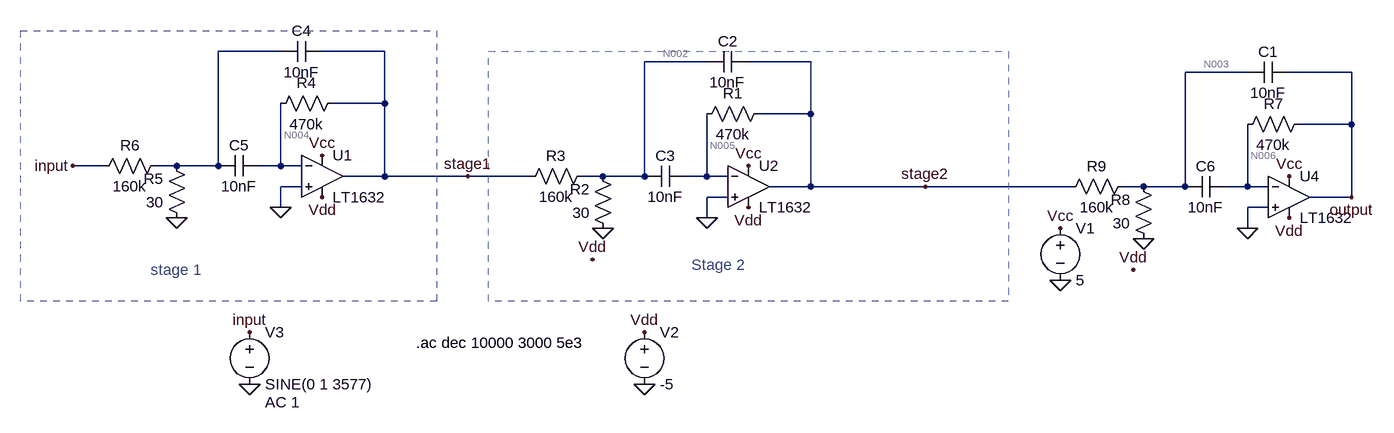
[diagram p0: schematic 2stageamplifiyer.asc]
2stageamplifiyer.asc, the LTspice schematic file:
Version 4
SHEET 1 1824 680
WIRE -544 -64 -640 -64
WIRE -384 -64 -480 -64
WIRE 112 -48 16 -48
WIRE 272 -48 176 -48
WIRE 944 -32 848 -32
WIRE 1104 -32 1008 -32
WIRE -384 16 -384 -64
WIRE -384 16 -464 16
WIRE 272 32 272 -48
WIRE 272 32 192 32
WIRE 1104 48 1104 -32
WIRE 1104 48 1024 48
WIRE -816 112 -864 112
WIRE -704 112 -736 112
WIRE -640 112 -640 -64
WIRE -640 112 -704 112
WIRE -544 112 -544 16
WIRE -544 112 -576 112
WIRE -512 112 -544 112
WIRE -384 128 -384 16
WIRE -384 128 -448 128
WIRE -256 128 -384 128
WIRE -160 128 -256 128
WIRE -48 128 -80 128
WIRE 16 128 16 -48
WIRE 16 128 -48 128
WIRE 112 128 112 32
WIRE 112 128 80 128
WIRE 144 128 112 128
WIRE -512 144 -544 144
WIRE 272 144 272 32
WIRE 272 144 208 144
WIRE 448 144 272 144
WIRE 672 144 448 144
WIRE 784 144 752 144
WIRE 848 144 848 -32
WIRE 848 144 784 144
WIRE 944 144 944 48
WIRE 944 144 912 144
WIRE 976 144 944 144
WIRE 144 160 112 160
WIRE 1104 160 1104 48
WIRE 1104 160 1040 160
WIRE -544 176 -544 144
WIRE 976 176 944 176
WIRE 112 192 112 160
WIRE 944 208 944 176
FLAG 656 288 0
FLAG 656 208 Vcc
FLAG -48 208 0
FLAG 112 192 0
FLAG -704 192 0
FLAG -544 176 0
FLAG -864 112 input
FLAG -592 368 input
FLAG -592 448 0
FLAG -480 96 Vcc
FLAG 176 112 Vcc
FLAG 16 448 0
FLAG -64 256 Vdd
FLAG 16 368 Vdd
FLAG -480 160 Vdd
FLAG 176 176 Vdd
FLAG 784 224 0
FLAG 944 208 0
FLAG 1008 128 Vcc
FLAG 768 272 Vdd
FLAG 1008 192 Vdd
FLAG 1104 160 output
FLAG -256 128 stage1
FLAG 448 144 stage2
SYMBOL voltage 656 192 R0
WINDOW 123 0 0 Left 2
WINDOW 39 0 0 Left 2
SYMATTR InstName V1
SYMATTR Value 5
SYMBOL res 96 48 R270
WINDOW 0 32 56 VTop 2
WINDOW 3 0 56 VBottom 2
SYMATTR InstName R1
SYMATTR Value 470k
SYMBOL res -32 224 R180
WINDOW 0 36 76 Left 2
WINDOW 3 36 40 Left 2
SYMATTR InstName R2
SYMATTR Value 30
SYMBOL res -176 144 R270
WINDOW 0 32 56 VTop 2
WINDOW 3 0 56 VBottom 2
SYMATTR InstName R3
SYMATTR Value 160k
SYMBOL cap 176 -64 R90
WINDOW 0 0 32 VBottom 2
WINDOW 3 32 32 VTop 2
SYMATTR InstName C2
SYMATTR Value 10nF
SYMBOL cap 80 112 R90
WINDOW 0 0 32 VBottom 2
WINDOW 3 32 32 VTop 2
SYMATTR InstName C3
SYMATTR Value 10nF
SYMBOL res -560 32 R270
WINDOW 0 32 56 VTop 2
WINDOW 3 0 56 VBottom 2
SYMATTR InstName R4
SYMATTR Value 470k
SYMBOL res -688 208 R180
WINDOW 0 36 76 Left 2
WINDOW 3 36 40 Left 2
SYMATTR InstName R5
SYMATTR Value 30
SYMBOL res -832 128 R270
WINDOW 0 32 56 VTop 2
WINDOW 3 0 56 VBottom 2
SYMATTR InstName R6
SYMATTR Value 160k
SYMBOL cap -480 -80 R90
WINDOW 0 0 32 VBottom 2
WINDOW 3 32 32 VTop 2
SYMATTR InstName C4
SYMATTR Value 10nF
SYMBOL cap -576 96 R90
WINDOW 0 0 32 VBottom 2
WINDOW 3 32 32 VTop 2
SYMATTR InstName C5
SYMATTR Value 10nF
SYMBOL voltage -592 352 R0
WINDOW 123 24 124 Left 2
WINDOW 39 0 0 Left 2
SYMATTR Value2 AC 1
SYMATTR InstName V3
SYMATTR Value SINE(0 1 3577)
SYMBOL voltage 16 352 R0
WINDOW 123 0 0 Left 2
WINDOW 39 0 0 Left 2
SYMATTR InstName V2
SYMATTR Value -5
SYMBOL Opamps\\LT1632 -480 64 R0
SYMATTR InstName U1
SYMBOL Opamps\\LT1632 176 80 R0
SYMATTR InstName U2
SYMBOL res 928 64 R270
WINDOW 0 32 56 VTop 2
WINDOW 3 0 56 VBottom 2
SYMATTR InstName R7
SYMATTR Value 470k
SYMBOL res 800 240 R180
WINDOW 0 36 76 Left 2
WINDOW 3 36 40 Left 2
SYMATTR InstName R8
SYMATTR Value 30
SYMBOL res 656 160 R270
WINDOW 0 32 56 VTop 2
WINDOW 3 0 56 VBottom 2
SYMATTR InstName R9
SYMATTR Value 160k
SYMBOL cap 1008 -48 R90
WINDOW 0 0 32 VBottom 2
WINDOW 3 32 32 VTop 2
SYMATTR InstName C1
SYMATTR Value 10nF
SYMBOL cap 912 128 R90
WINDOW 0 0 32 VBottom 2
WINDOW 3 32 32 VTop 2
SYMATTR InstName C6
SYMATTR Value 10nF
SYMBOL Opamps\\LT1632 1008 96 R0
SYMATTR InstName U4
TEXT 88 264 Left 2 ;Stage 2
TEXT -336 384 Left 2 !.ac dec 10000 3000 5e3
TEXT -744 272 Left 2 ;stage 1
RECTANGLE Normal 576 320 -224 -64 2
RECTANGLE Normal -304 320 -944 -96 2

The netlist it stands for:
* 2stageamplifiyer.asc
V1 Vcc 0 5
R1 N005 stage2 470k
R2 0 N002 30
R3 stage1 N002 160k
C2 stage2 N002 10nF
C3 N005 N002 10nF
R4 N004 stage1 470k
R5 0 N001 30
R6 input N001 160k
C4 stage1 N001 10nF
C5 N004 N001 10nF
V3 input 0 SINE(0 1 3577) AC 1
V2 Vdd 0 -5
XU1 0 N004 Vcc Vdd stage1 LT1632  ; pins In+ In- V+ V- OUT
XU2 0 N005 Vcc Vdd stage2 LT1632  ; pins In+ In- V+ V- OUT
R7 N006 output 470k
R8 0 N003 30
R9 stage2 N003 160k
C1 output N003 10nF
C6 N006 N003 10nF
XU4 0 N006 Vcc Vdd output LT1632  ; pins In+ In- V+ V- OUT
* Stage 2
.ac dec 10000 3000 5e3
* stage 1
.lib LTC.lib
.backanno
.end

* Results of the author's LTspice run, read from the files saved beside the schematic
* Operating Point, zero values left out:
*   V(vcc) = 5 V
*   V(n005) = 1.322 µV
*   V(stage2) = -541.8 mV
*   V(n002) = -101.6 µV
*   V(stage1) = -541.8 mV
*   V(n004) = 1.322 µV
*   V(vdd) = -5 V
*   V(n006) = 1.31 µV
*   V(output) = -541.8 mV
*   V(n003) = -101.6 µV
*   I(R9) = -3.386 µA
*   I(R8) = 3.386 µA
*   I(R7) = 1.153 µA
*   I(R4) = 1.153 µA
*   I(R3) = -3.386 µA
*   I(R2) = 3.386 µA
*   I(R1) = 1.153 µA
*   I(V2) = 13.14 mA
*   I(V1) = -13.13 mA
*   Ix(u1:1) = -1.153 µA
*   Ix(u1:2) = -1.153 µA
*   Ix(u1:3) = 4.377 mA
*   Ix(u1:4) = -4.38 mA
*   Ix(u1:5) = 4.538 µA
*   Ix(u2:1) = -1.153 µA
*   Ix(u2:2) = -1.153 µA
*   Ix(u2:3) = 4.377 mA
*   Ix(u2:4) = -4.38 mA
*   Ix(u2:5) = 4.538 µA
*   Ix(u4:1) = -1.153 µA
*   Ix(u4:2) = -1.153 µA
*   Ix(u4:3) = 4.379 mA
*   Ix(u4:4) = -4.378 mA
*   Ix(u4:5) = 1.153 µA
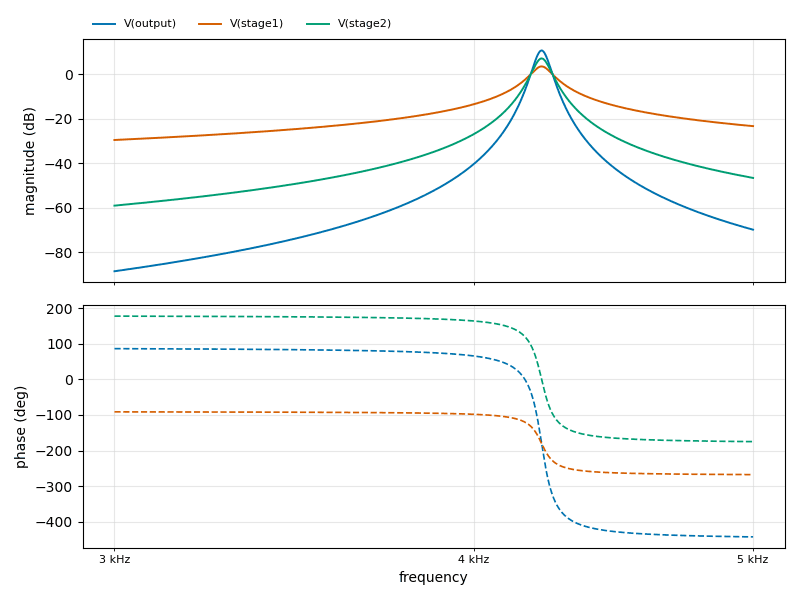
[diagram p1: AC Analysis of 2stageamplifiyer.asc, plotted from the saved traces]
* AC Analysis, 1 run:
*   V(output): -88.47 dB at 3 kHz, -69.79 dB at 5 kHz, peak 10.73 dB at 4.222 kHz, 3 dB below the peak at 4.205 kHz and 4.239 kHz
*   V(stage1): -29.49 dB at 3 kHz, -23.26 dB at 5 kHz, peak 3.57 dB at 4.222 kHz, 3 dB below the peak at 4.189 kHz and 4.255 kHz
*   V(stage2): -58.98 dB at 3 kHz, -46.53 dB at 5 kHz, peak 7.15 dB at 4.222 kHz, 3 dB below the peak at 4.201 kHz and 4.243 kHz